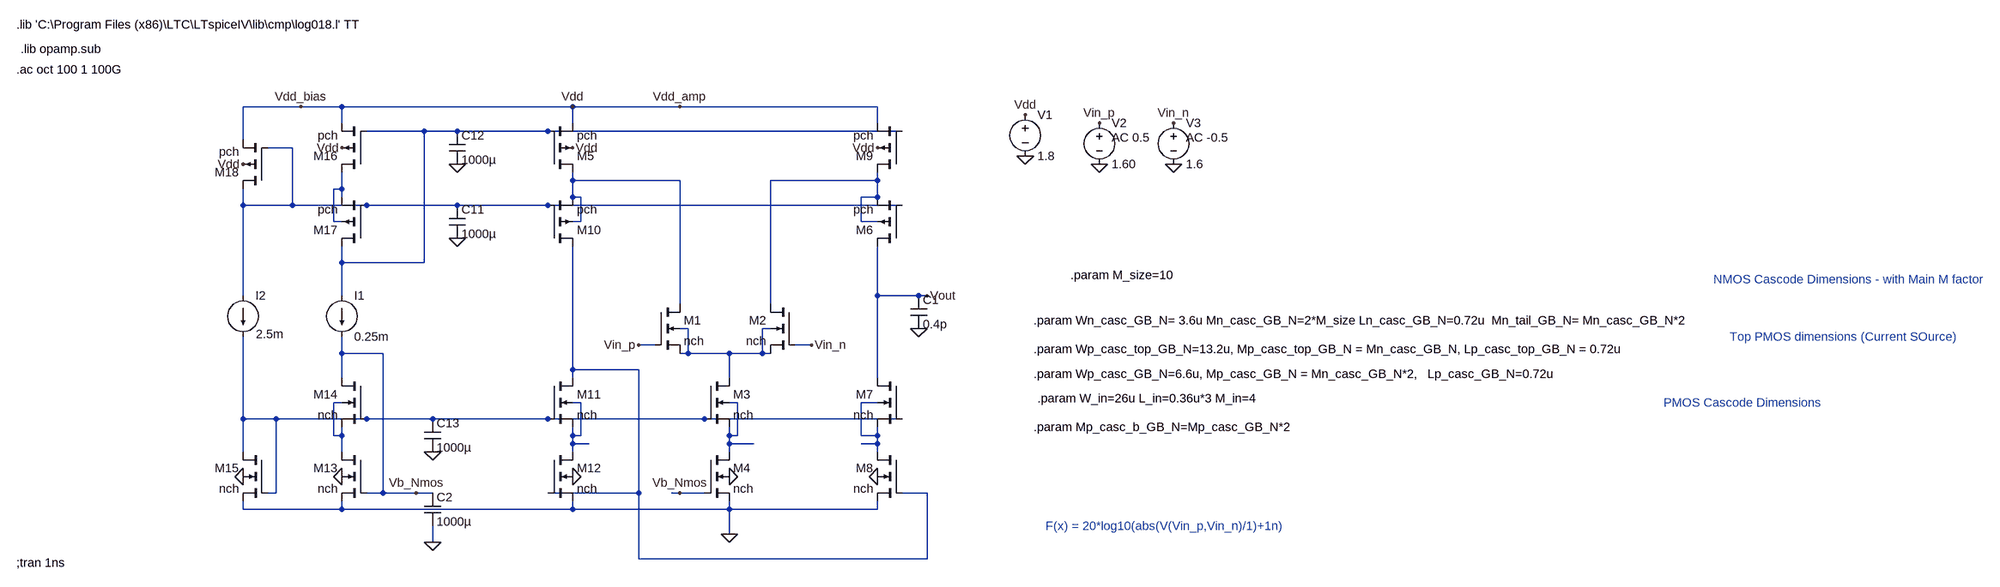
[diagram p0: schematic GB-NMOS.asc]
GB-NMOS.asc, the LTspice schematic file:
Version 4
SHEET 1 3836 784
WIRE 352 -864 240 -864
WIRE 432 -864 352 -864
WIRE 880 -864 432 -864
WIRE 1088 -864 880 -864
WIRE 1376 -864 1088 -864
WIRE 1472 -864 1376 -864
WIRE 432 -832 432 -864
WIRE 880 -832 880 -864
WIRE 1472 -832 1472 -864
WIRE 544 -816 480 -816
WIRE 592 -816 544 -816
WIRE 656 -816 592 -816
WIRE 832 -816 656 -816
WIRE 1520 -816 832 -816
WIRE 240 -800 240 -864
WIRE 336 -784 288 -784
WIRE 880 -720 880 -736
WIRE 992 -720 880 -720
WIRE 1088 -720 992 -720
WIRE 1360 -720 1264 -720
WIRE 1472 -720 1472 -736
WIRE 1472 -720 1360 -720
WIRE 432 -704 432 -736
WIRE 432 -704 416 -704
WIRE 432 -688 432 -704
WIRE 880 -688 880 -720
WIRE 896 -688 880 -688
WIRE 1472 -688 1472 -720
WIRE 1472 -688 1440 -688
WIRE 240 -672 240 -704
WIRE 336 -672 336 -784
WIRE 336 -672 240 -672
WIRE 480 -672 336 -672
WIRE 528 -672 480 -672
WIRE 656 -672 528 -672
WIRE 832 -672 656 -672
WIRE 1520 -672 832 -672
WIRE 416 -640 416 -704
WIRE 432 -640 416 -640
WIRE 896 -640 896 -688
WIRE 896 -640 880 -640
WIRE 1440 -640 1440 -688
WIRE 1472 -640 1440 -640
WIRE 1088 -608 1088 -720
WIRE 432 -560 432 -592
WIRE 592 -560 592 -816
WIRE 592 -560 432 -560
WIRE 1472 -560 1472 -592
WIRE 880 -544 880 -592
WIRE 240 -496 240 -672
WIRE 432 -496 432 -560
WIRE 1472 -496 1472 -560
WIRE 1552 -496 1472 -496
WIRE 1568 -496 1552 -496
WIRE 1088 -480 1088 -608
WIRE 1264 -480 1264 -720
WIRE 1104 -432 1088 -432
WIRE 1264 -432 1248 -432
WIRE 1040 -400 1008 -400
WIRE 1344 -400 1312 -400
WIRE 432 -384 432 -416
WIRE 512 -384 432 -384
WIRE 1104 -384 1104 -432
WIRE 1104 -384 1088 -384
WIRE 1184 -384 1104 -384
WIRE 1248 -384 1248 -432
WIRE 1248 -384 1184 -384
WIRE 1264 -384 1248 -384
WIRE 880 -352 880 -544
WIRE 1008 -352 880 -352
WIRE 432 -336 432 -384
WIRE 880 -336 880 -352
WIRE 1184 -336 1184 -384
WIRE 1472 -336 1472 -496
WIRE 432 -288 416 -288
WIRE 896 -288 880 -288
WIRE 1200 -288 1184 -288
WIRE 1472 -288 1440 -288
WIRE 240 -256 240 -416
WIRE 304 -256 240 -256
WIRE 480 -256 304 -256
WIRE 608 -256 480 -256
WIRE 656 -256 608 -256
WIRE 832 -256 656 -256
WIRE 1136 -256 832 -256
WIRE 1520 -256 1136 -256
WIRE 416 -224 416 -288
WIRE 432 -224 432 -240
WIRE 432 -224 416 -224
WIRE 880 -224 880 -240
WIRE 896 -224 896 -288
WIRE 896 -224 880 -224
WIRE 1184 -224 1184 -240
WIRE 1200 -224 1200 -288
WIRE 1200 -224 1184 -224
WIRE 1440 -224 1440 -288
WIRE 1472 -224 1472 -240
WIRE 1472 -224 1440 -224
WIRE 880 -208 880 -224
WIRE 912 -208 880 -208
WIRE 1184 -208 1184 -224
WIRE 1232 -208 1184 -208
WIRE 1472 -208 1472 -224
WIRE 1472 -208 1440 -208
WIRE 240 -192 240 -256
WIRE 432 -192 432 -224
WIRE 880 -192 880 -208
WIRE 1184 -192 1184 -208
WIRE 1472 -192 1472 -208
WIRE 304 -112 304 -256
WIRE 304 -112 288 -112
WIRE 512 -112 512 -384
WIRE 512 -112 480 -112
WIRE 576 -112 512 -112
WIRE 608 -112 576 -112
WIRE 1008 -112 1008 -352
WIRE 1008 -112 832 -112
WIRE 1088 -112 1072 -112
WIRE 1136 -112 1088 -112
WIRE 1568 -112 1520 -112
WIRE 240 -80 240 -96
WIRE 432 -80 432 -96
WIRE 432 -80 240 -80
WIRE 880 -80 880 -96
WIRE 880 -80 432 -80
WIRE 1184 -80 1184 -96
WIRE 1184 -80 880 -80
WIRE 1472 -80 1472 -96
WIRE 1472 -80 1184 -80
WIRE 1184 -32 1184 -80
WIRE 608 -16 608 -48
WIRE 1008 16 1008 -112
WIRE 1568 16 1568 -112
WIRE 1568 16 1008 16
FLAG 1184 -144 0
FLAG 1184 -32 0
FLAG 880 -144 0
FLAG 880 -864 Vdd
FLAG 880 -784 Vdd
FLAG 432 -144 0
FLAG 240 -144 0
FLAG 432 -784 Vdd
FLAG 240 -752 Vdd
FLAG 1472 -144 0
FLAG 1472 -784 Vdd
FLAG 608 -16 0
FLAG 1008 -400 Vin_p
FLAG 1344 -400 Vin_n
FLAG 656 -608 0
FLAG 656 -752 0
FLAG 608 -192 0
FLAG 576 -112 Vb_Nmos
FLAG 1088 -112 Vb_Nmos
FLAG 1568 -496 Vout
FLAG 1552 -432 0
FLAG 1872 -848 Vdd
FLAG 1872 -768 0
FLAG 2016 -752 0
FLAG 2160 -752 0
FLAG 2016 -832 Vin_p
FLAG 2160 -832 Vin_n
FLAG 352 -864 Vdd_bias
FLAG 1088 -864 Vdd_amp
DATAFLAG 912 -208 "round($*10k)/10k"
DATAFLAG 1184 -384 "round($*10k)/10k"
DATAFLAG 1232 -208 "round($*10k)/10k"
DATAFLAG 992 -720 "round($*1k)/1k"
DATAFLAG 880 -544 "round($*1k)/1k"
DATAFLAG 1440 -208 "round($*10k)/10k"
DATAFLAG 1360 -720 "round($*1k)/1k"
DATAFLAG 1376 -864 "round($*1k)/1k"
DATAFLAG 1472 -560 "round($*1k)/1k"
DATAFLAG 1088 -608 "Id(M1)"
DATAFLAG 544 -816 ""
DATAFLAG 528 -672 ""
DATAFLAG 656 -256 ""
DATAFLAG 816 -368 "Id(M11)"
DATAFLAG 960 -832 "-Id(M5)"
DATAFLAG 1104 -208 "Id(M4)"
DATAFLAG 608 -112 ""
SYMBOL nmos4 1040 -480 R0
SYMATTR InstName M1
SYMATTR Value nch
SYMATTR Value2 l={L_in} w={W_in} m={M_in}
SYMBOL nmos4 1136 -336 R0
SYMATTR InstName M3
SYMATTR Value nch
SYMATTR Value2 l={Ln_casc_GB_N} w={Wn_casc_GB_N} m={Mn_tail_GB_N}
SYMBOL nmos4 1136 -192 R0
SYMATTR InstName M4
SYMATTR Value nch
SYMATTR Value2 l={Ln_casc_GB_N} w={Wn_casc_GB_N} m={Mn_tail_GB_N}
SYMBOL pmos4 832 -592 M180
SYMATTR InstName M10
SYMATTR Value pch
SYMATTR Value2 l={Lp_casc_GB_N} w={Wp_casc_GB_N} m={Mp_casc_GB_N}
SYMBOL nmos4 832 -336 R0
SYMATTR InstName M11
SYMATTR Value nch
SYMATTR Value2 l={Ln_casc_GB_N} w={Wn_casc_GB_N} m={Mn_casc_GB_N}
SYMBOL nmos4 832 -192 R0
SYMATTR InstName M12
SYMATTR Value nch
SYMATTR Value2 l={Ln_casc_GB_N} w={Wn_casc_GB_N} m={Mn_casc_GB_N}
SYMBOL pmos4 832 -736 M180
SYMATTR InstName M5
SYMATTR Value pch
SYMATTR Value2 l={Lp_casc_top_GB_N} w={Wp_casc_top_GB_N} m={Mp_casc_top_GB_N}
SYMBOL nmos4 480 -192 M0
SYMATTR InstName M13
SYMATTR Value nch
SYMATTR Value2 l={Ln_casc_GB_N} w={Wn_casc_GB_N} m={Mn_tail_GB_N}
SYMBOL current 432 -496 R0
WINDOW 123 0 0 Left 2
WINDOW 39 0 0 Left 2
SYMATTR InstName I1
SYMATTR Value 0.25m
SYMBOL nmos4 480 -336 M0
SYMATTR InstName M14
SYMATTR Value nch
SYMATTR Value2 l={Ln_casc_GB_N} w={Wn_casc_GB_N} m={Mn_tail_GB_N}
SYMBOL current 240 -496 R0
WINDOW 123 0 0 Left 2
WINDOW 39 0 0 Left 2
WINDOW 3 25 75 Left 2
SYMATTR Value 2.5m
SYMATTR InstName I2
SYMBOL nmos4 288 -192 M0
SYMATTR InstName M15
SYMATTR Value nch
SYMATTR Value2 l={Ln_casc_GB_N} w={Wn_casc_GB_N} m={Mn_tail_GB_N}
SYMBOL pmos4 480 -736 R180
SYMATTR InstName M16
SYMATTR Value pch
SYMATTR Value2 l={Lp_casc_top_GB_N} w={Wp_casc_top_GB_N} m={Mp_casc_top_GB_N}
SYMBOL pmos4 480 -592 R180
SYMATTR InstName M17
SYMATTR Value pch
SYMATTR Value2 l={Lp_casc_GB_N} w={Wp_casc_GB_N} m={Mp_casc_GB_N}
SYMBOL pmos4 288 -704 R180
SYMATTR InstName M18
SYMATTR Value pch
SYMATTR Value2 l={Lp_casc_GB_N} w={Wp_casc_GB_N} m={Mp_casc_b_GB_N}
SYMBOL nmos4 1312 -480 M0
SYMATTR InstName M2
SYMATTR Value nch
SYMATTR Value2 l={L_in} w={w_in} m={M_in}
SYMBOL pmos4 1520 -592 R180
SYMATTR InstName M6
SYMATTR Value pch
SYMATTR Value2 l={Lp_casc_GB_N} w={Wp_casc_GB_N} m={Mp_casc_GB_N}
SYMBOL nmos4 1520 -336 M0
SYMATTR InstName M7
SYMATTR Value nch
SYMATTR Value2 l={Ln_casc_GB_N} w={Wn_Casc_GB_N} m={Mn_casc_GB_N}
SYMBOL nmos4 1520 -192 M0
SYMATTR InstName M8
SYMATTR Value nch
SYMATTR Value2 l={Ln_casc_GB_N} w={Wn_Casc_GB_N} m={Mn_casc_GB_N}
SYMBOL pmos4 1520 -736 R180
SYMATTR InstName M9
SYMATTR Value pch
SYMATTR Value2 l={Lp_casc_top_GB_N} w={Wp_casc_top_GB_N} m={Mp_casc_top_GB_N}
SYMBOL cap 592 -112 R0
SYMATTR InstName C2
SYMATTR Value 1000µ
SYMBOL cap 640 -672 R0
SYMATTR InstName C11
SYMATTR Value 1000µ
SYMBOL cap 640 -816 R0
SYMATTR InstName C12
SYMATTR Value 1000µ
SYMBOL cap 592 -256 R0
SYMATTR InstName C13
SYMATTR Value 1000µ
SYMBOL cap 1536 -496 R0
SYMATTR InstName C1
SYMATTR Value 0.4p
SYMBOL Overige\ componenten\\voltage 1872 -864 R0
WINDOW 123 0 0 Left 2
WINDOW 39 0 0 Left 2
SYMATTR InstName V1
SYMATTR Value 1.8
SYMBOL Overige\ componenten\\voltage 2016 -848 R0
WINDOW 123 24 44 Left 2
WINDOW 39 0 0 Left 2
SYMATTR Value2 AC 0.5
SYMATTR InstName V2
SYMATTR Value 1.60
SYMBOL Overige\ componenten\\voltage 2160 -848 R0
WINDOW 123 24 44 Left 2
WINDOW 39 0 0 Left 2
SYMATTR Value2 AC -0.5
SYMATTR InstName V3
SYMATTR Value 1.6
TEXT -200 -1024 Left 2 !.lib 'C:\\Program Files (x86)\\LTC\\LTspiceIV\\lib\\cmp\\log018.l' TT
TEXT -192 -976 Left 2 !.lib opamp.sub
TEXT 1888 -448 Left 2 !.param Wn_casc_GB_N= 3.6u Mn_casc_GB_N=2*M_size Ln_casc_GB_N=0.72u  Mn_tail_GB_N= Mn_casc_GB_N*2
TEXT 1888 -344 Left 2 !.param Wp_casc_GB_N=6.6u, Mp_casc_GB_N = Mn_casc_GB_N*2,   Lp_casc_GB_N=0.72u
TEXT 1888 -392 Left 2 !.param Wp_casc_top_GB_N=13.2u, Mp_casc_top_GB_N = Mn_casc_GB_N, Lp_casc_top_GB_N = 0.72u
TEXT 1912 -48 Left 2 ;F(x) = 20*log10(abs(V(Vin_p,Vin_n)/1)+1n)
TEXT 3240 -416 Left 2 ;Top PMOS dimensions (Current SOurce)
TEXT 3112 -288 Left 2 ;PMOS Cascode Dimensions
TEXT 3208 -528 Left 2 ;NMOS Cascode Dimensions - with Main M factor
TEXT 1888 -240 Left 2 !.param Mp_casc_b_GB_N=Mp_casc_GB_N*2
TEXT -200 24 Left 2 !;tran 1ns
TEXT -200 -936 Left 2 !.ac oct 100 1 100G
TEXT 1896 -296 Left 2 !.param W_in=26u L_in=0.36u*3 M_in=4
TEXT 1960 -536 Left 2 !.param M_size=10

The netlist it stands for:
* GB-NMOS.asc
M1 N003 Vin_p N007 N007 nch l={L_in} w={W_in} m={M_in}
M3 N007 N012 N010 N010 nch l={Ln_casc_GB_N} w={Wn_casc_GB_N} m={Mn_tail_GB_N}
M4 N010 Vb_Nmos 0 0 nch l={Ln_casc_GB_N} w={Wn_casc_GB_N} m={Mn_tail_GB_N}
M10 N006 N002 N003 N003 pch l={Lp_casc_GB_N} w={Wp_casc_GB_N} m={Mp_casc_GB_N}
M11 N006 N012 N009 N009 nch l={Ln_casc_GB_N} w={Wn_casc_GB_N} m={Mn_casc_GB_N}
M12 N009 N006 0 0 nch l={Ln_casc_GB_N} w={Wn_casc_GB_N} m={Mn_casc_GB_N}
M5 N003 N001 Vdd_amp Vdd_amp pch l={Lp_casc_top_GB_N} w={Wp_casc_top_GB_N} m={Mp_casc_top_GB_N}
M13 N008 Vb_Nmos 0 0 nch l={Ln_casc_GB_N} w={Wn_casc_GB_N} m={Mn_tail_GB_N}
I1 N001 Vb_Nmos 0.25m
M14 Vb_Nmos N012 N008 N008 nch l={Ln_casc_GB_N} w={Wn_casc_GB_N} m={Mn_tail_GB_N}
I2 N002 N012 2.5m
M15 N012 N012 0 0 nch l={Ln_casc_GB_N} w={Wn_casc_GB_N} m={Mn_tail_GB_N}
M16 N005 N001 Vdd_amp Vdd_amp pch l={Lp_casc_top_GB_N} w={Wp_casc_top_GB_N} m={Mp_casc_top_GB_N}
M17 N001 N002 N005 N005 pch l={Lp_casc_GB_N} w={Wp_casc_GB_N} m={Mp_casc_GB_N}
M18 N002 N002 Vdd_amp Vdd_amp pch l={Lp_casc_GB_N} w={Wp_casc_GB_N} m={Mp_casc_b_GB_N}
M2 N004 Vin_n N007 N007 nch l={L_in} w={w_in} m={M_in}
M6 Vout N002 N004 N004 pch l={Lp_casc_GB_N} w={Wp_casc_GB_N} m={Mp_casc_GB_N}
M7 Vout N012 N011 N011 nch l={Ln_casc_GB_N} w={Wn_Casc_GB_N} m={Mn_casc_GB_N}
M8 N011 N006 0 0 nch l={Ln_casc_GB_N} w={Wn_Casc_GB_N} m={Mn_casc_GB_N}
M9 N004 N001 Vdd_amp Vdd_amp pch l={Lp_casc_top_GB_N} w={Wp_casc_top_GB_N} m={Mp_casc_top_GB_N}
C2 Vb_Nmos 0 1000µ
C11 N002 0 1000µ
C12 N001 0 1000µ
C13 N012 0 1000µ
C1 Vout 0 0.4p
V1 Vdd_amp 0 1.8
V2 Vin_p 0 1.60 AC 0.5
V3 Vin_n 0 1.6 AC -0.5
.model NMOS NMOS
.model PMOS PMOS
.lib standard.mos
.lib 'C:\Program Files (x86)\LTC\LTspiceIV\lib\cmp\log018.l' TT
.lib opamp.sub
.param Wn_casc_GB_N= 3.6u Mn_casc_GB_N=2*M_size Ln_casc_GB_N=0.72u  Mn_tail_GB_N= Mn_casc_GB_N*2
.param Wp_casc_GB_N=6.6u, Mp_casc_GB_N = Mn_casc_GB_N*2,   Lp_casc_GB_N=0.72u
.param Wp_casc_top_GB_N=13.2u, Mp_casc_top_GB_N = Mn_casc_GB_N, Lp_casc_top_GB_N = 0.72u
* F(x) = 20*log10(abs(V(Vin_p,Vin_n)/1)+1n)
* Top PMOS dimensions (Current SOurce)
* PMOS Cascode Dimensions
* NMOS Cascode Dimensions - with Main M factor
.param Mp_casc_b_GB_N=Mp_casc_GB_N*2
;tran 1ns
.ac oct 100 1 100G
.param W_in=26u L_in=0.36u*3 M_in=4
.param M_size=10
.backanno
.end